# Altium schematic sheet Analog Transmission.SchDoc
size 381 x 635 mm
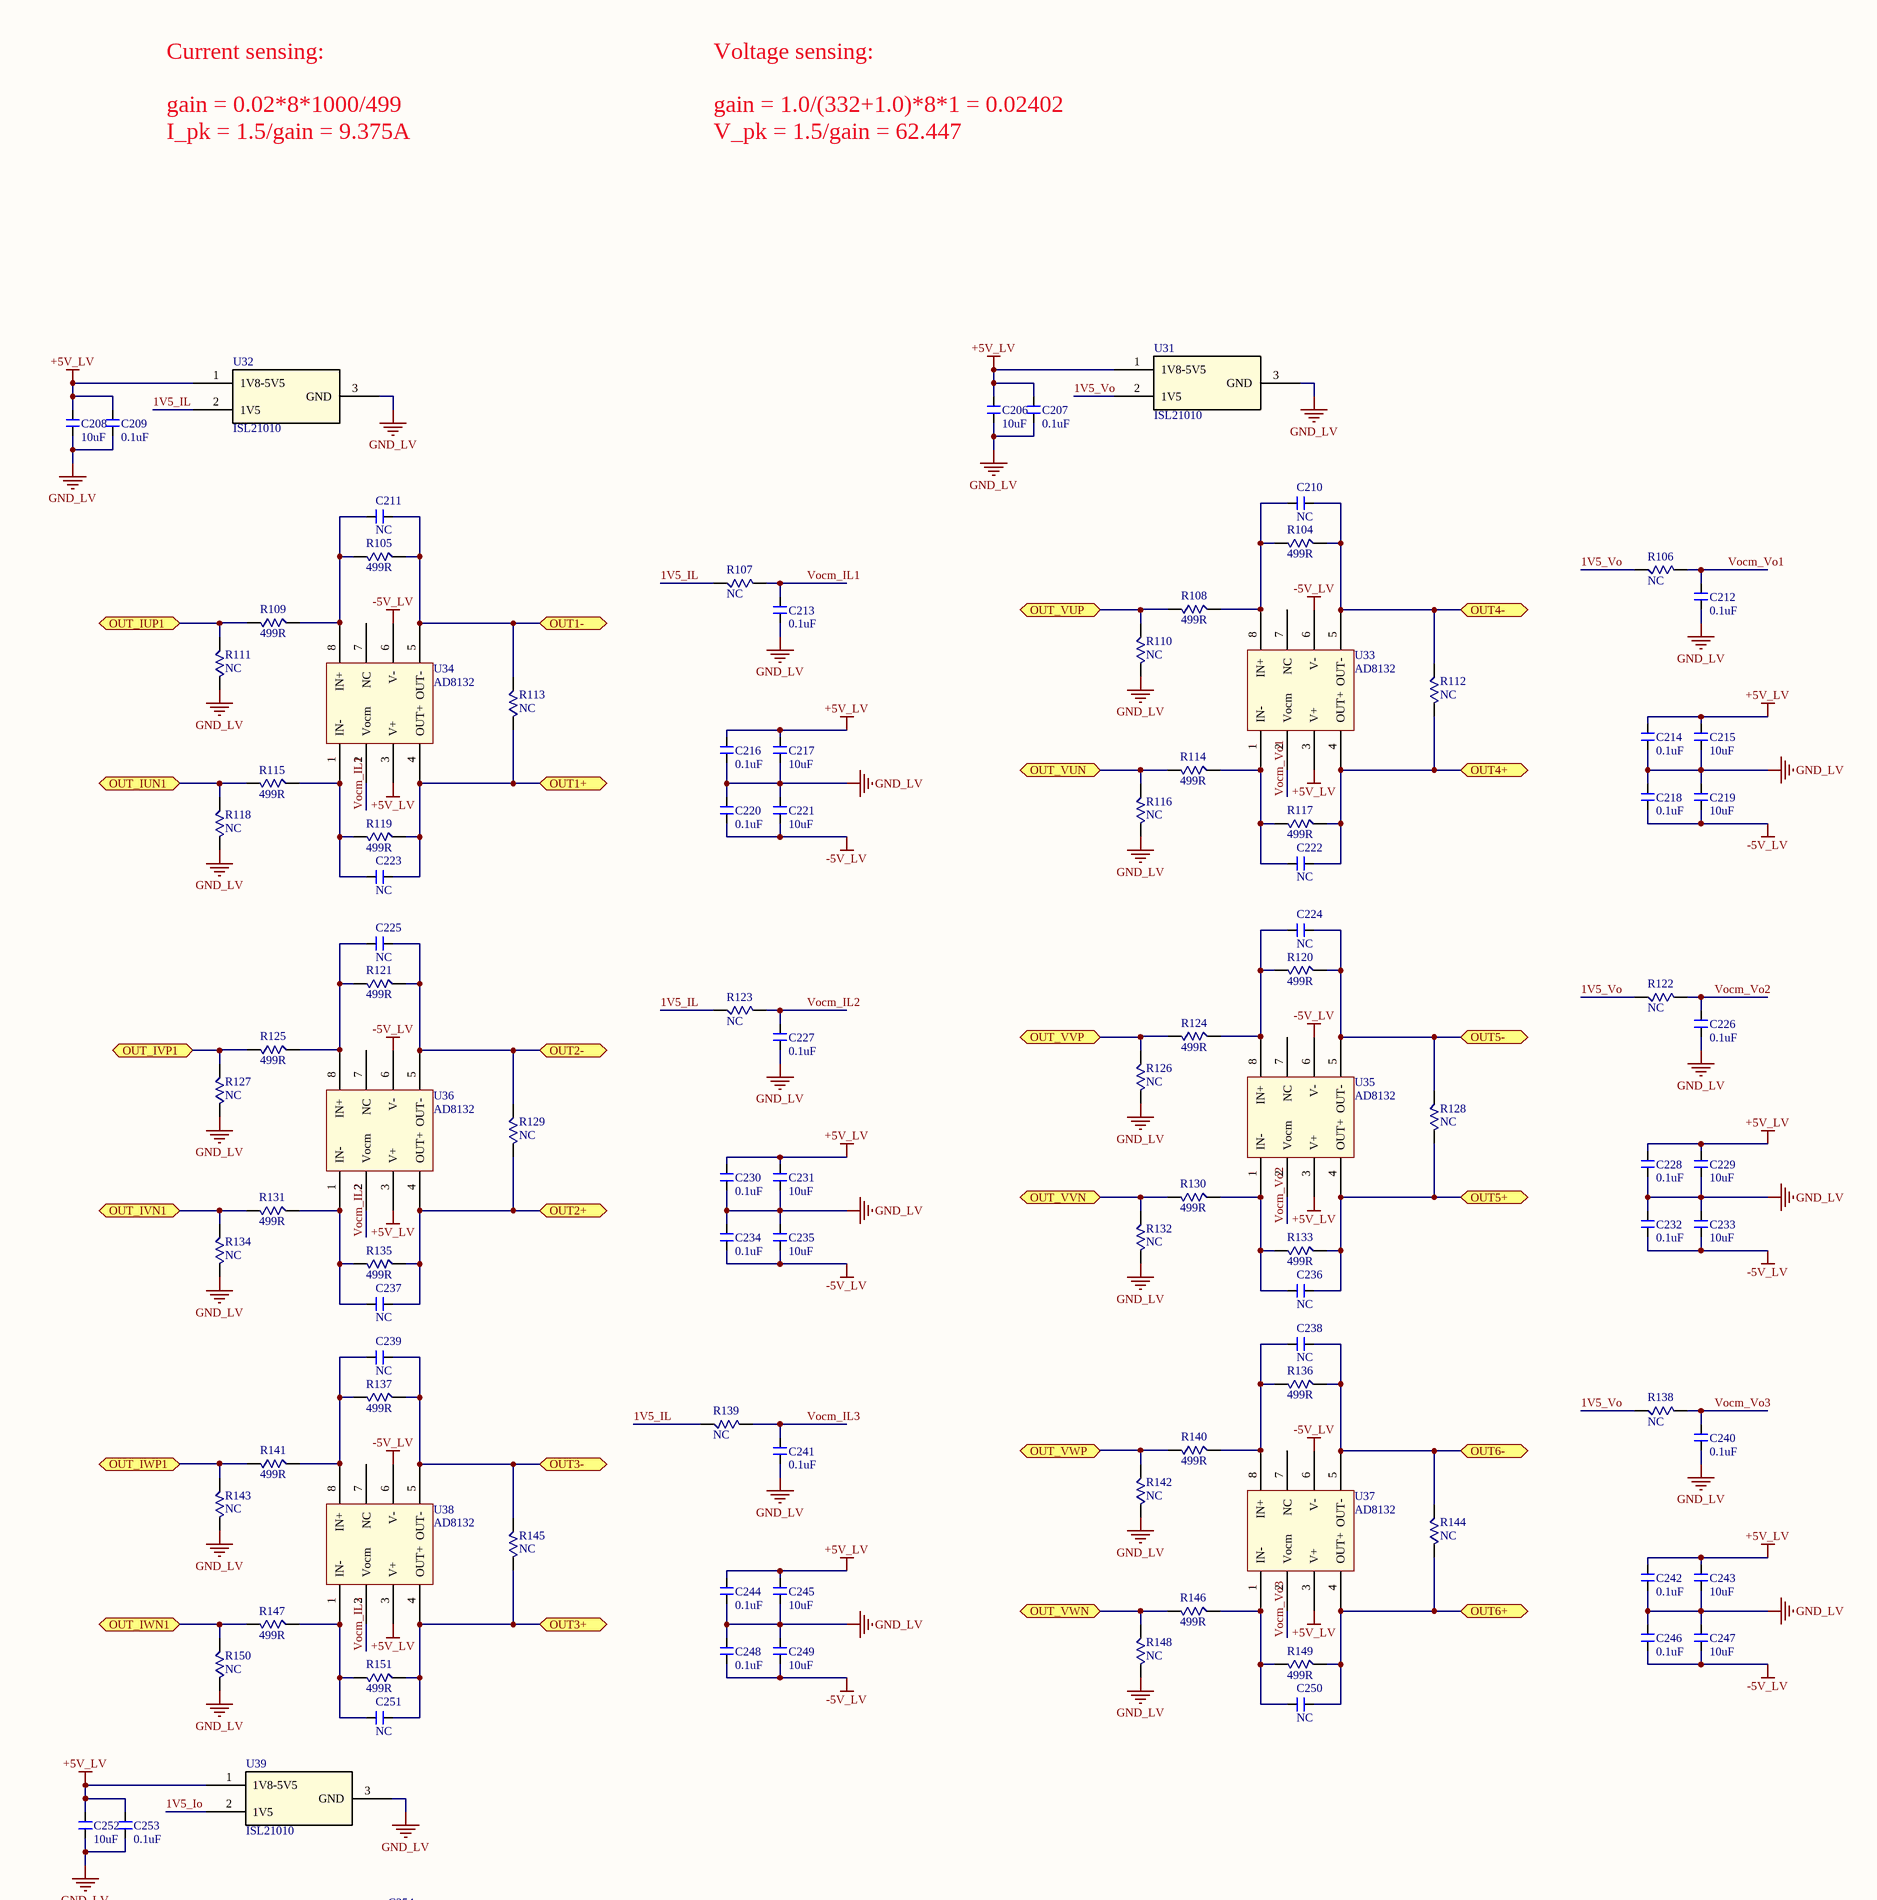
[diagram p0: Analog Transmission.SchDoc, top]
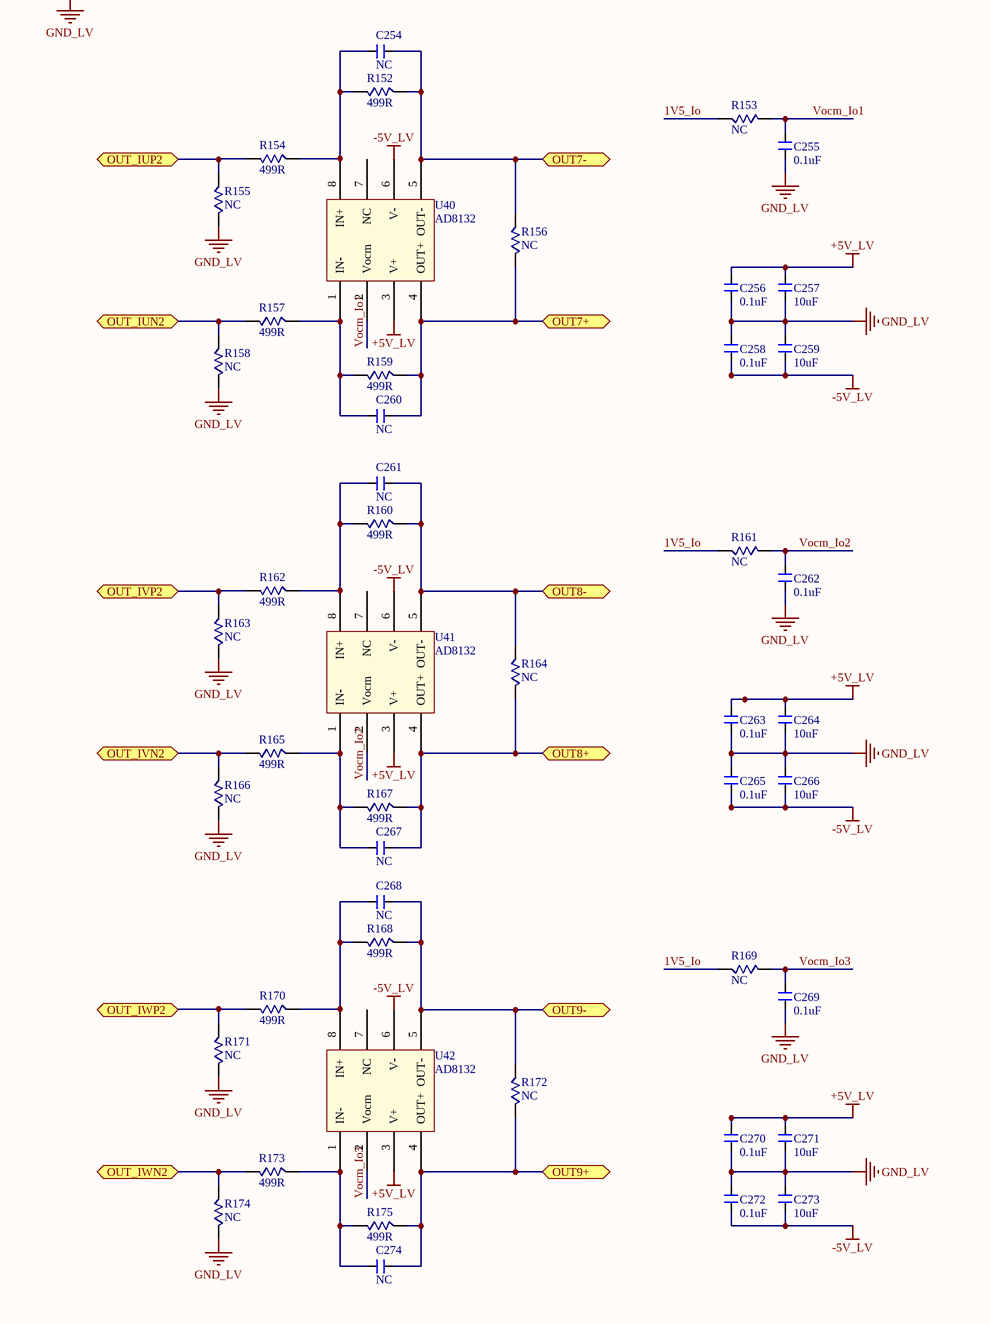
[diagram p1: Analog Transmission.SchDoc, bottom]

## Parts
C206  value 10uF  [0603 (1608 Metric)]  (hidden comment: Cap 0603_new)
C207  value 0.1uF  [0603 (1608 Metric)]  (hidden comment: Cap 0603_new)
C208  value 10uF  [0603 (1608 Metric)]  (hidden comment: Cap 0603_new)
C209  value 0.1uF  [0603 (1608 Metric)]  (hidden comment: Cap 0603_new)
C210  value NC  [0603 (1608 Metric)]  (hidden comment: Cap 0603_new)
C211  value NC  [0603 (1608 Metric)]  (hidden comment: Cap 0603_new)
C212  value 0.1uF  [0603 (1608 Metric)]  (hidden comment: Cap 0603_new)
C213  value 0.1uF  [0603 (1608 Metric)]  (hidden comment: Cap 0603_new)
C214  value 0.1uF  [0603 (1608 Metric)]  (hidden comment: Cap 0603_new)
C215  value 10uF  [0603 (1608 Metric)]  (hidden comment: Cap 0603_new)
C216  value 0.1uF  [0603 (1608 Metric)]  (hidden comment: Cap 0603_new)
C217  value 10uF  [0603 (1608 Metric)]  (hidden comment: Cap 0603_new)
C218  value 0.1uF  [0603 (1608 Metric)]  (hidden comment: Cap 0603_new)
C219  value 10uF  [0603 (1608 Metric)]  (hidden comment: Cap 0603_new)
C220  value 0.1uF  [0603 (1608 Metric)]  (hidden comment: Cap 0603_new)
C221  value 10uF  [0603 (1608 Metric)]  (hidden comment: Cap 0603_new)
C222  value NC  [0603 (1608 Metric)]  (hidden comment: Cap 0603_new)
C223  value NC  [0603 (1608 Metric)]  (hidden comment: Cap 0603_new)
C224  value NC  [0603 (1608 Metric)]  (hidden comment: Cap 0603_new)
C225  value NC  [0603 (1608 Metric)]  (hidden comment: Cap 0603_new)
C226  value 0.1uF  [0603 (1608 Metric)]  (hidden comment: Cap 0603_new)
C227  value 0.1uF  [0603 (1608 Metric)]  (hidden comment: Cap 0603_new)
C228  value 0.1uF  [0603 (1608 Metric)]  (hidden comment: Cap 0603_new)
C229  value 10uF  [0603 (1608 Metric)]  (hidden comment: Cap 0603_new)
C230  value 0.1uF  [0603 (1608 Metric)]  (hidden comment: Cap 0603_new)
C231  value 10uF  [0603 (1608 Metric)]  (hidden comment: Cap 0603_new)
C232  value 0.1uF  [0603 (1608 Metric)]  (hidden comment: Cap 0603_new)
C233  value 10uF  [0603 (1608 Metric)]  (hidden comment: Cap 0603_new)
C234  value 0.1uF  [0603 (1608 Metric)]  (hidden comment: Cap 0603_new)
C235  value 10uF  [0603 (1608 Metric)]  (hidden comment: Cap 0603_new)
C236  value NC  [0603 (1608 Metric)]  (hidden comment: Cap 0603_new)
C237  value NC  [0603 (1608 Metric)]  (hidden comment: Cap 0603_new)
C238  value NC  [0603 (1608 Metric)]  (hidden comment: Cap 0603_new)
C239  value NC  [0603 (1608 Metric)]  (hidden comment: Cap 0603_new)
C240  value 0.1uF  [0603 (1608 Metric)]  (hidden comment: Cap 0603_new)
C241  value 0.1uF  [0603 (1608 Metric)]  (hidden comment: Cap 0603_new)
C242  value 0.1uF  [0603 (1608 Metric)]  (hidden comment: Cap 0603_new)
C243  value 10uF  [0603 (1608 Metric)]  (hidden comment: Cap 0603_new)
C244  value 0.1uF  [0603 (1608 Metric)]  (hidden comment: Cap 0603_new)
C245  value 10uF  [0603 (1608 Metric)]  (hidden comment: Cap 0603_new)
C246  value 0.1uF  [0603 (1608 Metric)]  (hidden comment: Cap 0603_new)
C247  value 10uF  [0603 (1608 Metric)]  (hidden comment: Cap 0603_new)
C248  value 0.1uF  [0603 (1608 Metric)]  (hidden comment: Cap 0603_new)
C249  value 10uF  [0603 (1608 Metric)]  (hidden comment: Cap 0603_new)
C250  value NC  [0603 (1608 Metric)]  (hidden comment: Cap 0603_new)
C251  value NC  [0603 (1608 Metric)]  (hidden comment: Cap 0603_new)
C252  value 10uF  [0603 (1608 Metric)]  (hidden comment: Cap 0603_new)
C253  value 0.1uF  [0603 (1608 Metric)]  (hidden comment: Cap 0603_new)
C254  value NC  [0603 (1608 Metric)]  (hidden comment: Cap 0603_new)
C255  value 0.1uF  [0603 (1608 Metric)]  (hidden comment: Cap 0603_new)
C256  value 0.1uF  [0603 (1608 Metric)]  (hidden comment: Cap 0603_new)
C257  value 10uF  [0603 (1608 Metric)]  (hidden comment: Cap 0603_new)
C258  value 0.1uF  [0603 (1608 Metric)]  (hidden comment: Cap 0603_new)
C259  value 10uF  [0603 (1608 Metric)]  (hidden comment: Cap 0603_new)
C260  value NC  [0603 (1608 Metric)]  (hidden comment: Cap 0603_new)
C261  value NC  [0603 (1608 Metric)]  (hidden comment: Cap 0603_new)
C262  value 0.1uF  [0603 (1608 Metric)]  (hidden comment: Cap 0603_new)
C263  value 0.1uF  [0603 (1608 Metric)]  (hidden comment: Cap 0603_new)
C264  value 10uF  [0603 (1608 Metric)]  (hidden comment: Cap 0603_new)
C265  value 0.1uF  [0603 (1608 Metric)]  (hidden comment: Cap 0603_new)
C266  value 10uF  [0603 (1608 Metric)]  (hidden comment: Cap 0603_new)
C267  value NC  [0603 (1608 Metric)]  (hidden comment: Cap 0603_new)
C268  value NC  [0603 (1608 Metric)]  (hidden comment: Cap 0603_new)
C269  value 0.1uF  [0603 (1608 Metric)]  (hidden comment: Cap 0603_new)
C270  value 0.1uF  [0603 (1608 Metric)]  (hidden comment: Cap 0603_new)
C271  value 10uF  [0603 (1608 Metric)]  (hidden comment: Cap 0603_new)
C272  value 0.1uF  [0603 (1608 Metric)]  (hidden comment: Cap 0603_new)
C273  value 10uF  [0603 (1608 Metric)]  (hidden comment: Cap 0603_new)
C274  value NC  [0603 (1608 Metric)]  (hidden comment: Cap 0603_new)
R104  value 499R  [0603 (1608 Metric)]  (hidden comment: Resistor 0603)
R105  value 499R  [0603 (1608 Metric)]  (hidden comment: Resistor 0603)
R106  value NC  [0603 (1608 Metric)]  (hidden comment: Resistor 0603)
R107  value NC  [0603 (1608 Metric)]  (hidden comment: Resistor 0603)
R108  value 499R  [0603 (1608 Metric)]  (hidden comment: Resistor 0603)
R109  value 499R  [0603 (1608 Metric)]  (hidden comment: Resistor 0603)
R110  value NC  [0603 (1608 Metric)]  (hidden comment: Resistor 0603)
R111  value NC  [0603 (1608 Metric)]  (hidden comment: Resistor 0603)
R112  value NC  [0603 (1608 Metric)]  (hidden comment: Resistor 0603)
R113  value NC  [0603 (1608 Metric)]  (hidden comment: Resistor 0603)
R114  value 499R  [0603 (1608 Metric)]  (hidden comment: Resistor 0603)
R115  value 499R  [0603 (1608 Metric)]  (hidden comment: Resistor 0603)
R116  value NC  [0603 (1608 Metric)]  (hidden comment: Resistor 0603)
R117  value 499R  [0603 (1608 Metric)]  (hidden comment: Resistor 0603)
R118  value NC  [0603 (1608 Metric)]  (hidden comment: Resistor 0603)
R119  value 499R  [0603 (1608 Metric)]  (hidden comment: Resistor 0603)
R120  value 499R  [0603 (1608 Metric)]  (hidden comment: Resistor 0603)
R121  value 499R  [0603 (1608 Metric)]  (hidden comment: Resistor 0603)
R122  value NC  [0603 (1608 Metric)]  (hidden comment: Resistor 0603)
R123  value NC  [0603 (1608 Metric)]  (hidden comment: Resistor 0603)
R124  value 499R  [0603 (1608 Metric)]  (hidden comment: Resistor 0603)
R125  value 499R  [0603 (1608 Metric)]  (hidden comment: Resistor 0603)
R126  value NC  [0603 (1608 Metric)]  (hidden comment: Resistor 0603)
R127  value NC  [0603 (1608 Metric)]  (hidden comment: Resistor 0603)
R128  value NC  [0603 (1608 Metric)]  (hidden comment: Resistor 0603)
R129  value NC  [0603 (1608 Metric)]  (hidden comment: Resistor 0603)
R130  value 499R  [0603 (1608 Metric)]  (hidden comment: Resistor 0603)
R131  value 499R  [0603 (1608 Metric)]  (hidden comment: Resistor 0603)
R132  value NC  [0603 (1608 Metric)]  (hidden comment: Resistor 0603)
R133  value 499R  [0603 (1608 Metric)]  (hidden comment: Resistor 0603)
R134  value NC  [0603 (1608 Metric)]  (hidden comment: Resistor 0603)
R135  value 499R  [0603 (1608 Metric)]  (hidden comment: Resistor 0603)
R136  value 499R  [0603 (1608 Metric)]  (hidden comment: Resistor 0603)
R137  value 499R  [0603 (1608 Metric)]  (hidden comment: Resistor 0603)
R138  value NC  [0603 (1608 Metric)]  (hidden comment: Resistor 0603)
R139  value NC  [0603 (1608 Metric)]  (hidden comment: Resistor 0603)
R140  value 499R  [0603 (1608 Metric)]  (hidden comment: Resistor 0603)
R141  value 499R  [0603 (1608 Metric)]  (hidden comment: Resistor 0603)
R142  value NC  [0603 (1608 Metric)]  (hidden comment: Resistor 0603)
R143  value NC  [0603 (1608 Metric)]  (hidden comment: Resistor 0603)
R144  value NC  [0603 (1608 Metric)]  (hidden comment: Resistor 0603)
R145  value NC  [0603 (1608 Metric)]  (hidden comment: Resistor 0603)
R146  value 499R  [0603 (1608 Metric)]  (hidden comment: Resistor 0603)
R147  value 499R  [0603 (1608 Metric)]  (hidden comment: Resistor 0603)
R148  value NC  [0603 (1608 Metric)]  (hidden comment: Resistor 0603)
R149  value 499R  [0603 (1608 Metric)]  (hidden comment: Resistor 0603)
R150  value NC  [0603 (1608 Metric)]  (hidden comment: Resistor 0603)
R151  value 499R  [0603 (1608 Metric)]  (hidden comment: Resistor 0603)
R152  value 499R  [0603 (1608 Metric)]  (hidden comment: Resistor 0603)
R153  value NC  [0603 (1608 Metric)]  (hidden comment: Resistor 0603)
R154  value 499R  [0603 (1608 Metric)]  (hidden comment: Resistor 0603)
R155  value NC  [0603 (1608 Metric)]  (hidden comment: Resistor 0603)
R156  value NC  [0603 (1608 Metric)]  (hidden comment: Resistor 0603)
R157  value 499R  [0603 (1608 Metric)]  (hidden comment: Resistor 0603)
R158  value NC  [0603 (1608 Metric)]  (hidden comment: Resistor 0603)
R159  value 499R  [0603 (1608 Metric)]  (hidden comment: Resistor 0603)
R160  value 499R  [0603 (1608 Metric)]  (hidden comment: Resistor 0603)
R161  value NC  [0603 (1608 Metric)]  (hidden comment: Resistor 0603)
R162  value 499R  [0603 (1608 Metric)]  (hidden comment: Resistor 0603)
R163  value NC  [0603 (1608 Metric)]  (hidden comment: Resistor 0603)
R164  value NC  [0603 (1608 Metric)]  (hidden comment: Resistor 0603)
R165  value 499R  [0603 (1608 Metric)]  (hidden comment: Resistor 0603)
R166  value NC  [0603 (1608 Metric)]  (hidden comment: Resistor 0603)
R167  value 499R  [0603 (1608 Metric)]  (hidden comment: Resistor 0603)
R168  value 499R  [0603 (1608 Metric)]  (hidden comment: Resistor 0603)
R169  value NC  [0603 (1608 Metric)]  (hidden comment: Resistor 0603)
R170  value 499R  [0603 (1608 Metric)]  (hidden comment: Resistor 0603)
R171  value NC  [0603 (1608 Metric)]  (hidden comment: Resistor 0603)
R172  value NC  [0603 (1608 Metric)]  (hidden comment: Resistor 0603)
R173  value 499R  [0603 (1608 Metric)]  (hidden comment: Resistor 0603)
R174  value NC  [0603 (1608 Metric)]  (hidden comment: Resistor 0603)
R175  value 499R  [0603 (1608 Metric)]  (hidden comment: Resistor 0603)
U31  ISL21010  [SOT_23]
U32  ISL21010  [SOT_23]
U33  AD8132  [SO8_L]
U34  AD8132  [SO8_L]
U35  AD8132  [SO8_L]
U36  AD8132  [SO8_L]
U37  AD8132  [SO8_L]
U38  AD8132  [SO8_L]
U39  ISL21010  [SOT_23]
U40  AD8132  [SO8_L]
U41  AD8132  [SO8_L]
U42  AD8132  [SO8_L]

## Ports
OUT1+, OUT1-, OUT2+, OUT2-, OUT3+, OUT3-, OUT4+, OUT4-, OUT5+, OUT5-, OUT6+, OUT6-, OUT7+, OUT7-, OUT8+, OUT8-, OUT9+, OUT9-, OUT_IUN1, OUT_IUN2, OUT_IUP1, OUT_IUP2, OUT_IVN1, OUT_IVN2, OUT_IVP1, OUT_IVP2, OUT_IWN1, OUT_IWN2, OUT_IWP1, OUT_IWP2, OUT_VUN, OUT_VUP, OUT_VVN, OUT_VVP, OUT_VWN, OUT_VWP

## Nets
+5V_LV: C206.2(OUT) C207.2(OUT) C208.2(OUT) C209.2(OUT) C214.2(OUT) C215.2(OUT) C216.2(OUT) C217.2(OUT) C228.2(OUT) C229.2(OUT) C230.2(OUT) C231.2(OUT) C242.2(OUT) C243.2(OUT) C244.2(OUT) C245.2(OUT) C252.2(OUT) C253.2(OUT) C256.2(OUT) C257.2(OUT) C263.2(OUT) C264.2(OUT) C270.2(OUT) C271.2(OUT) U31.1(1V8-5V5) U32.1(1V8-5V5) U33.3(V+) U34.3(V+) U35.3(V+) U36.3(V+) U37.3(V+) U38.3(V+) U39.1(1V8-5V5) U40.3(V+) U41.3(V+) U42.3(V+)
-5V_LV: C218.1(OUT) C219.1(OUT) C220.1(OUT) C221.1(OUT) C232.1(OUT) C233.1(OUT) C234.1(OUT) C235.1(OUT) C246.1(OUT) C247.1(OUT) C248.1(OUT) C249.1(OUT) C258.1(OUT) C259.1(OUT) C265.1(OUT) C266.1(OUT) C272.1(OUT) C273.1(OUT) U33.6(V-) U34.6(V-) U35.6(V-) U36.6(V-) U37.6(V-) U38.6(V-) U40.6(V-) U41.6(V-) U42.6(V-)
GND_LV: C206.1(OUT) C207.1(OUT) C208.1(OUT) C209.1(OUT) C212.1(OUT) C213.1(OUT) C214.1(OUT) C215.1(OUT) C216.1(OUT) C217.1(OUT) C218.2(OUT) C219.2(OUT) C220.2(OUT) C221.2(OUT) C226.1(OUT) C227.1(OUT) C228.1(OUT) C229.1(OUT) C230.1(OUT) C231.1(OUT) C232.2(OUT) C233.2(OUT) C234.2(OUT) C235.2(OUT) C240.1(OUT) C241.1(OUT) C242.1(OUT) C243.1(OUT) C244.1(OUT) C245.1(OUT) C246.2(OUT) C247.2(OUT) C248.2(OUT) C249.2(OUT) C252.1(OUT) C253.1(OUT) C255.1(OUT) C256.1(OUT) C257.1(OUT) C258.2(OUT) C259.2(OUT) C262.1(OUT) C263.1(OUT) C264.1(OUT) C265.2(OUT) C266.2(OUT) C269.1(OUT) C270.1(OUT) C271.1(OUT) C272.2(OUT) C273.2(OUT) R110.2(A) R111.2(A) R116.2(A) R118.2(A) R126.2(A) R127.2(A) R132.2(A) R134.2(A) R142.2(A) R143.2(A) R148.2(A) R150.2(A) R155.2(A) R158.2(A) R163.2(A) R166.2(A) R171.2(A) R174.2(A) U31.3(GND) U32.3(GND) U39.3(GND)
1V5_IL: R107.1(A) R123.1(A) R139.1(A) U32.2(1V5)
1V5_Io: R153.1(A) R161.1(A) R169.1(A) U39.2(1V5)
1V5_Vo: R106.1(A) R122.1(A) R138.1(A) U31.2(1V5)
OUT1+: C223.1(OUT) R113.2(A) R119.1(A) U34.4(OUT+) ; port OUT1+
OUT1-: C211.1(OUT) R105.1(A) R113.1(A) U34.5(OUT-) ; port OUT1-
OUT2+: C237.1(OUT) R129.2(A) R135.1(A) U36.4(OUT+) ; port OUT2+
OUT2-: C225.1(OUT) R121.1(A) R129.1(A) U36.5(OUT-) ; port OUT2-
OUT3+: C251.1(OUT) R145.2(A) R151.1(A) U38.4(OUT+) ; port OUT3+
OUT3-: C239.1(OUT) R137.1(A) R145.1(A) U38.5(OUT-) ; port OUT3-
OUT4+: C222.1(OUT) R112.2(A) R117.1(A) U33.4(OUT+) ; port OUT4+
OUT4-: C210.1(OUT) R104.1(A) R112.1(A) U33.5(OUT-) ; port OUT4-
OUT5+: C236.1(OUT) R128.2(A) R133.1(A) U35.4(OUT+) ; port OUT5+
OUT5-: C224.1(OUT) R120.1(A) R128.1(A) U35.5(OUT-) ; port OUT5-
OUT6+: C250.1(OUT) R144.2(A) R149.1(A) U37.4(OUT+) ; port OUT6+
OUT6-: C238.1(OUT) R136.1(A) R144.1(A) U37.5(OUT-) ; port OUT6-
OUT7+: C260.1(OUT) R156.2(A) R159.1(A) U40.4(OUT+) ; port OUT7+
OUT7-: C254.1(OUT) R152.1(A) R156.1(A) U40.5(OUT-) ; port OUT7-
OUT8+: C267.1(OUT) R164.2(A) R167.1(A) U41.4(OUT+) ; port OUT8+
OUT8-: C261.1(OUT) R160.1(A) R164.1(A) U41.5(OUT-) ; port OUT8-
OUT9+: C274.1(OUT) R172.2(A) R175.1(A) U42.4(OUT+) ; port OUT9+
OUT9-: C268.1(OUT) R168.1(A) R172.1(A) U42.5(OUT-) ; port OUT9-
OUT_IUN1: R115.2(A) R118.1(A) ; port OUT_IUN1
OUT_IUN2: R157.2(A) R158.1(A) ; port OUT_IUN2
OUT_IUP1: R109.2(A) R111.1(A) ; port OUT_IUP1
OUT_IUP2: R154.2(A) R155.1(A) ; port OUT_IUP2
OUT_IVN1: R131.2(A) R134.1(A) ; port OUT_IVN1
OUT_IVN2: R165.2(A) R166.1(A) ; port OUT_IVN2
OUT_IVP1: R125.2(A) R127.1(A) ; port OUT_IVP1
OUT_IVP2: R162.2(A) R163.1(A) ; port OUT_IVP2
OUT_IWN1: R147.2(A) R150.1(A) ; port OUT_IWN1
OUT_IWN2: R173.2(A) R174.1(A) ; port OUT_IWN2
OUT_IWP1: R141.2(A) R143.1(A) ; port OUT_IWP1
OUT_IWP2: R170.2(A) R171.1(A) ; port OUT_IWP2
OUT_VUN: R114.2(A) R116.1(A) ; port OUT_VUN
OUT_VUP: R108.2(A) R110.1(A) ; port OUT_VUP
OUT_VVN: R130.2(A) R132.1(A) ; port OUT_VVN
OUT_VVP: R124.2(A) R126.1(A) ; port OUT_VVP
OUT_VWN: R146.2(A) R148.1(A) ; port OUT_VWN
OUT_VWP: R140.2(A) R142.1(A) ; port OUT_VWP
Vocm_IL1: C213.2(OUT) R107.2(A) U34.2(Vocm)
Vocm_IL2: C227.2(OUT) R123.2(A) U36.2(Vocm)
Vocm_IL3: C241.2(OUT) R139.2(A) U38.2(Vocm)
Vocm_Io1: C255.2(OUT) R153.2(A) U40.2(Vocm)
Vocm_Io2: C262.2(OUT) R161.2(A) U41.2(Vocm)
Vocm_Io3: C269.2(OUT) R169.2(A) U42.2(Vocm)
Vocm_Vo1: C212.2(OUT) R106.2(A) U33.2(Vocm)
Vocm_Vo2: C226.2(OUT) R122.2(A) U35.2(Vocm)
Vocm_Vo3: C240.2(OUT) R138.2(A) U37.2(Vocm)
NetC210_2: C210.2(OUT) R104.2(A) R108.1(A) U33.8(IN+)
NetC211_2: C211.2(OUT) R105.2(A) R109.1(A) U34.8(IN+)
NetC222_2: C222.2(OUT) R114.1(A) R117.2(A) U33.1(IN-)
NetC223_2: C223.2(OUT) R115.1(A) R119.2(A) U34.1(IN-)
NetC224_2: C224.2(OUT) R120.2(A) R124.1(A) U35.8(IN+)
NetC225_2: C225.2(OUT) R121.2(A) R125.1(A) U36.8(IN+)
NetC236_2: C236.2(OUT) R130.1(A) R133.2(A) U35.1(IN-)
NetC237_2: C237.2(OUT) R131.1(A) R135.2(A) U36.1(IN-)
NetC238_2: C238.2(OUT) R136.2(A) R140.1(A) U37.8(IN+)
NetC239_2: C239.2(OUT) R137.2(A) R141.1(A) U38.8(IN+)
NetC250_2: C250.2(OUT) R146.1(A) R149.2(A) U37.1(IN-)
NetC251_2: C251.2(OUT) R147.1(A) R151.2(A) U38.1(IN-)
NetC254_2: C254.2(OUT) R152.2(A) R154.1(A) U40.8(IN+)
NetC260_2: C260.2(OUT) R157.1(A) R159.2(A) U40.1(IN-)
NetC261_2: C261.2(OUT) R160.2(A) R162.1(A) U41.8(IN+)
NetC267_2: C267.2(OUT) R165.1(A) R167.2(A) U41.1(IN-)
NetC268_2: C268.2(OUT) R168.2(A) R170.1(A) U42.8(IN+)
NetC274_2: C274.2(OUT) R173.1(A) R175.2(A) U42.1(IN-)

Not connected (* = marked no-connect by the designer): U33 7(NC); U34 7(NC); U35 7(NC); U36 7(NC); U37 7(NC); U38 7(NC); U40 7(NC); U41 7(NC); U42 7(NC)

## Notes on the sheet
- Current sensing:
  gain = 0.02*8*1000/499
  I_pk = 1.5/gain = 9.375A
- Voltage sensing:
  gain = 1.0/(332+1.0)*8*1 = 0.02402
  V_pk = 1.5/gain = 62.447

## Library data of the parts
C206 C208 C215 C217 C219 C221 C229 C231 C233 C235 C243 C245 C247 C249 C252 C257 C259 C264 C266 C271 C273 = Cap 0603_new: CAP CER 10UF 35V X5R 0805; part: 490-10515-1-ND
C207 C209 C212-C214 C216 C218 C220 C226-C228 C230 C232 C234 C240-C242 C244 C246 C248 C253 C255 C256 C258 C262 C263 C265 C269 C270 C272 = Cap 0603_new: CAP CER 0.1UF 50V Y5V 0603; part: 311-1343-6-ND
C210 C211 C222-C225 C236-C239 C250 C251 C254 C260 C261 C267 C268 C274 = Cap 0603_new: NC
R104 R105 R108 R109 R114 R115 R117 R119-R121 R124 R125 R130 R131 R133 R135-R137 R140 R141 R146 R147 R149 R151 R152 R154 R157 R159 R160 R162 R165 R167 R168 R170 R173 R175 = Resistor 0603: RES SMD 499 OHM 0.1% 1/10W 0603; Part: RG16P499BCT-ND
R106 R107 R110-R113 R116 R118 R122 R123 R126-R129 R132 R134 R138 R139 R142-R145 R148 R150 R153 R155 R156 R158 R161 R163 R164 R166 R169 R171 R172 R174 = Resistor 0603: NC
U31 U32 U39 = ISL21010: Series Voltage Reference IC ±0.2% 25mA SOT-23-3; Part: ISL21010CFH315Z-TKCT-ND
U33-U38 U40-U42 = AD8132: IC OPAMP DIFF 360MHZ 8MSOP; Part: AD8132WARMZ-R7CT-ND